# Altium schematic sheet Power.SchDoc
size A4; SheetNumber: 2; SheetTotal: 2
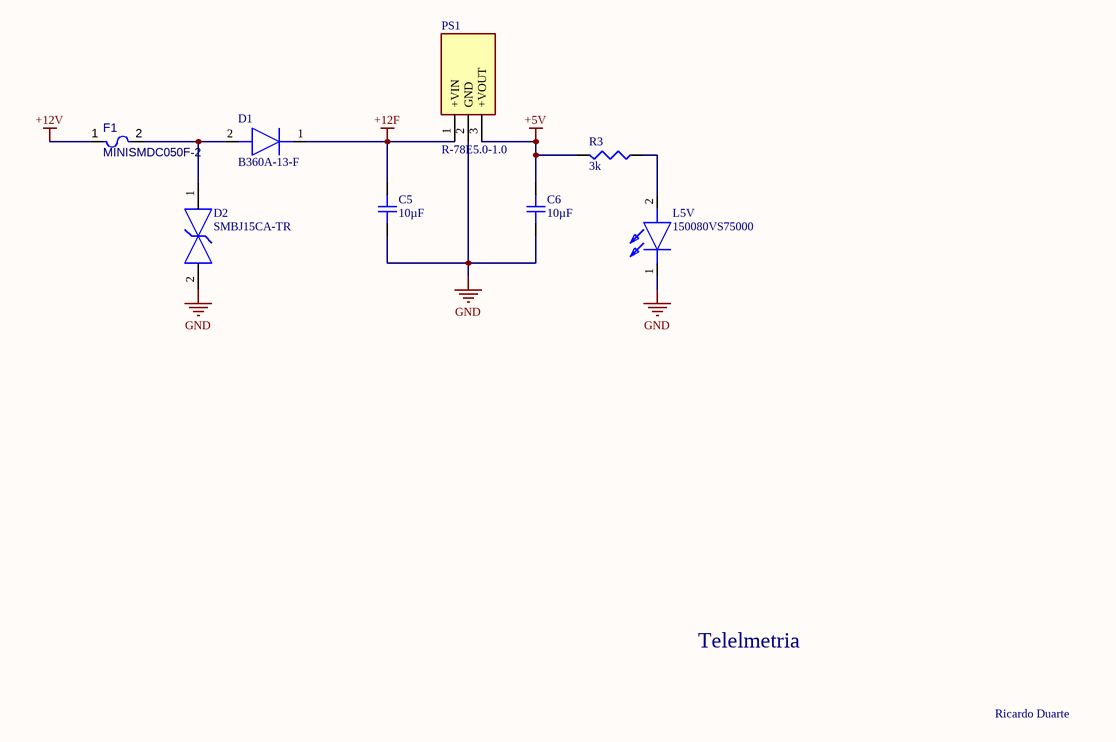
[diagram p0: Power.SchDoc]

## Parts
C5  value 10µF  [CAP_0805]  (hidden comment: 10uF)
C6  value 10µF  [CAP_0805]  (hidden comment: 10uF)
D1  B360A-13-F  [DIOM5226X240N]
D2  SMBJ15CA-TR  [FP-SMB-CA-MFG]
F1  MINISMDC050F-2  [MINISMDC050F-2-Footprint-1]
L5V  150080VS75000  [LEDC2012X80N]
PS1  R-78E5.0-1.0  [R78E5010]
R3  value 3k  [RES_0805]  (hidden comment: 4K7)

## Nets
+5V: C6.2 PS1.3(+VOUT) R3.2
+12F: C5.2 D1.1(K) PS1.1(+VIN)
+12V: F1.1
GND: C5.1 C6.1 D2.2 L5V.1(K) PS1.2(GND)
NetD1_2: D1.2(A) D2.1 F1.2
NetL5V_2: L5V.2(A) R3.1

## Notes on the sheet
- Telelmetria
- Ricardo Duarte

## Library data of the parts
C5 C6 = CMP-001-00011-2: Ceramic Capacitor, Multilayer, Ceramic, 25V, 10% +Tol, 10% -Tol, X5R, 15% TC, 10uF, Surface Mount, 0805; Reference Standard: AEC-Q200; Design Item ID: CAP_0805; Manufacturer: *; Max Operating Temperature: 85°C; Case/Package: 0805; Rating: *; Distributor Link: *; Min Operating Temperature: -55°C; Mounting Technology: Surface Mount; Rated DC Voltage (URdc): 25V; RoHS Compliant: Yes; Source: Schematic-Lib-PhilsLab.SchLib; Manufacturer Part Number: *; LCSC: *; Capacitor Type: Ceramic; Dielectric: *
D1 = CMP-039-000000-1: Diode; Manufacturer_Name: Diodes Inc.; Mouser Part Number: 621-B360A-F; Source: SamacSys.SchLib; Datasheet Link: https://www.diodes.com/assets/Datasheets/ds30891.pdf; Manufacturer_Part_Number: B360A-13-F; Arrow Price/Stock: https://www.arrow.com/en/products/b360a-13-f/diodes-incorporated?region=asia; Mouser Price/Stock: https://www.mouser.co.uk/ProductDetail/Diodes-Incorporated/B360A-13-F?qs=sVoUGXYOGv3xoCWNHVb4bA%3D%3D; Design Item ID: B360A-13-F; Arrow Part Number: B360A-13-F; Height: 2.4mm
D2 = CMP-004-00000-1: Trans Voltage Suppressor Diode, 4000W, 15V V(RWM), Bidirectional, 1 Element, Silicon, DO-214AA; Min Operating Temperature: -55°C; Pins: 2; Max Operating Temperature: 150°C; RoHS Compliant: Yes
F1 = CMP-005-00000-2: PTC Resettable Fuse, 24V, Surface Mount; Current Rating: 500mA
L5V = CMP-018-000003-2: Single Color LED, Bright Green, Water Clear, 1.4mm; Manufacturer_Name: Wurth Elektronik; Forward Current: 30mA; Luminous Intensity-Nom: 40mcd; Viewing Angle: 140°; Mounting Technology: Surface Mount; Design Item ID: 150080VS75000; Height: 0.8mm; Datasheet Link: http://katalog.we-online.com/led/datasheet/150080VS75000.pdf; Max Operating Temperature: 85°C; Source: SamacSys.SchLib; Color: Green; Min Operating Temperature: -40°C; Mouser Price/Stock: https://www.mouser.co.uk/ProductDetail/Wurth-Elektronik/150080VS75000?qs=LlUlMxKIyB0tGHJmO6%252B0ug%3D%3D; Pins: 2; Size: 1.4mm; Manufacturer_Part_Number: 150080VS75000; Mouser Part Number: 710-150080VS75000; RoHS Compliant: Yes
PS1 = R-78E5.0-1.0: Power Supply; Manufacturer_Name: RECOM Power; Datasheet Link: http://www.recom-power.com/pdf/Innoline/R-78Exx-1.0.pdf; Height: 10.4mm; Manufacturer_Part_Number: R-78E5.0-1.0; Mouser Part Number: 919-R-78E5.0-1.0; Mouser Price/Stock: https://www.mouser.co.uk/ProductDetail/RECOM-Power/R-78E5.0-1.0?qs=T0XSgvH75d4EsZCU9I5HVA%3D%3D; Arrow Part Number: R-78E5.0-1.0; Arrow Price/Stock: https://www.arrow.com/en/products/r-78e5.0-1.0/recom-power?utm_currency=USD&region=europe
R3 = CMP-009-00012-1: Resistor SMD 0805 4,7K; Design Item ID: RES_0805; LCSC: *; Distributor Link: *; Source: Schematic-Lib-PhilsLab.SchLib